# EAGLE schematic efi-shield-rev01 (EAGLE 7.3.0)

## Sheet 1 of 6: Connectors
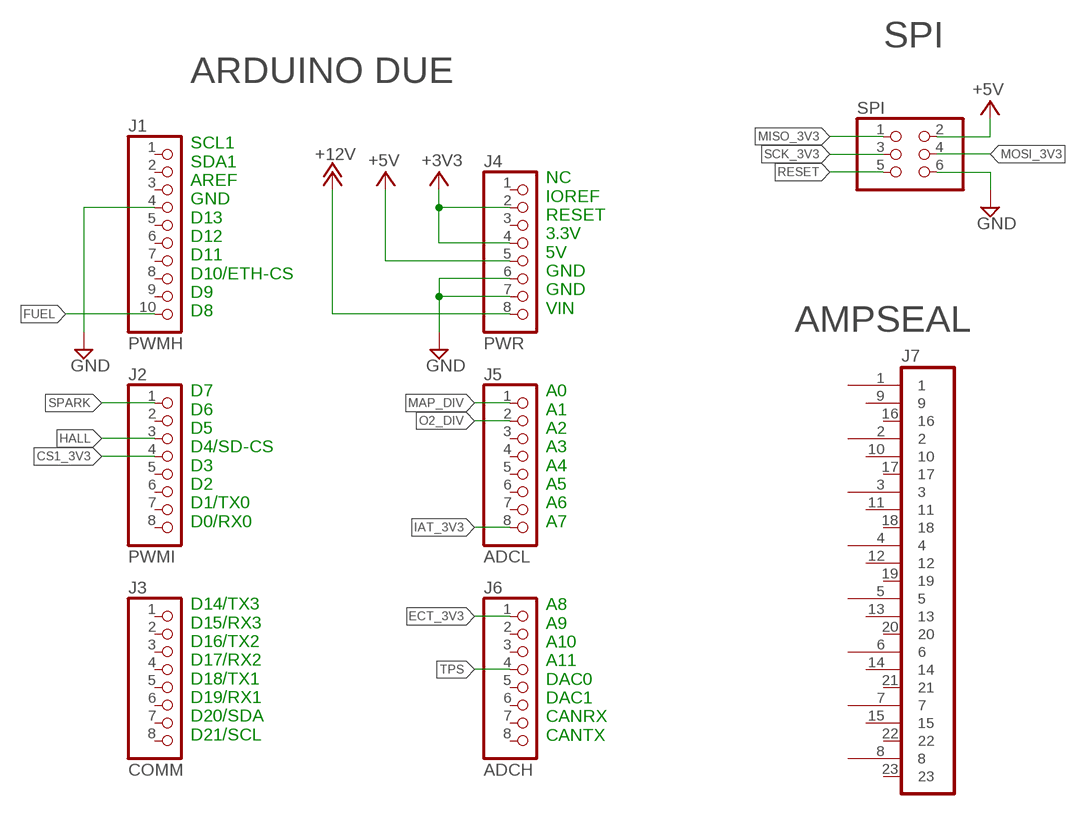
[diagram p0: schematic, sheet 1]

### Parts
J1  PWMH  PINHD-1X10  [1X10]
J2  PWMI  PINHD-1X8  [1X08]
J3  COMM  PINHD-1X8  [1X08]
J4  PWR  PINHD-1X8  [1X08]
J5  ADCL  PINHD-1X8  [1X08]
J6  ADCH  PINHD-1X8  [1X08]
J7  AMPSEAL-23POS-HEADER  [AMPSEAL-HEADER-23POS-RA]
SPI  PINHD-2X3  [2X03]

### Nets
+3V3: J4.2 J4.4
+5V: J4.5 SPI.2
+12V: J4.8
CS1_3V3: J2.4
ECT_3V3: J6.1
FUEL: J1.10
GND: J1.4 J4.6 J4.7 SPI.6
HALL: J2.3
IAT_3V3: J5.8
MAP_DIV: J5.1
MISO_3V3: SPI.1
MOSI_3V3: SPI.4
O2_DIV: J5.2
RESET: SPI.5
SCK_3V3: SPI.3
SPARK: J2.1
TPS: J6.4
Unconnected: J1.1 J1.2 J1.3 J1.5 J1.6 J1.7 J1.8 J1.9 J2.2 J2.5 J2.6 J2.7 J2.8 J3.1 J3.2 J3.3 J3.4 J3.5 J3.6 J3.7 J3.8 J4.1 J4.3 J5.3 J5.4 J5.5 J5.6 J5.7 J6.2 J6.3 J6.5 J6.6 J6.7 J6.8 J7.1 J7.2 J7.3 J7.4 J7.5 J7.6 J7.7 J7.8 J7.9 J7.10 J7.11 J7.12 J7.13 J7.14 J7.15 J7.16 J7.17 J7.18 J7.19 J7.20 J7.21 J7.22 J7.23

### Notes on the sheet
- SPI
- ARDUINO DUE
- SCL1
  SDA1
  AREF
  GND
  D13
  D12
  D11
  D10/ETH-CS
  D9
  D8
- NC
  IOREF
  RESET
  3.3V
  5V
  GND
  GND
  VIN
- AMPSEAL
- D7
  D6
  D5
  D4/SD-CS
  D3
  D2
  D1/TX0
  D0/RX0
- A0
  A1
  A2
  A3
  A4
  A5
  A6
  A7
- A8
  A9
  A10
  A11
  DAC0
  DAC1
  CANRX
  CANTX
- D14/TX3
  D15/RX3
  D16/TX2
  D17/RX2
  D18/TX1
  D19/RX1
  D20/SDA
  D21/SCL

## Sheet 2 of 6: ACTUATORS

## Sheet 3 of 6: FILTERS + ADC

## Sheet 4 of 6: TACH

## Sheet 5 of 6: CAN

## Sheet 6 of 6: LEDs

## Library data of the parts
J1 = cpsmv:PINHD-1X10: PIN HEADER; DATASHEET_LINK: http://www.joeknowselectronics.com/index.php/products/headers.html; MANUFACTURER: Joe Knows Electronics; MANUFACTURER_PN: n/a; PACKAGE: 1X10; SUPPLIER: Joe Knows Electronics; SUPPLIER_PN: n/a
J2-J6 = cpsmv:PINHD-1X8: PIN HEADER; DATASHEET_LINK: http://www.joeknowselectronics.com/index.php/products/headers.html; MANUFACTURER: Joe Knows Electronics; MANUFACTURER_PN: n/a; PACKAGE: 1X8; SUPPLIER: Joe Knows Electronics; SUPPLIER_PN: n/a
J7 = cpsmv:AMPSEAL-23POS-HEADER: 23 position male header, wire-to-board, sealing connector; DATASHEET_LINK: http://www.te.com/commerce/DocumentDelivery/DDEController?Action=srchrtrv&DocNm=776087&DocType=Customer+Drawing&DocLang=English; MANUFACTURER: TE Connectivity; MANUFACTURER_PN: 776087-1; PACKAGE: AMPSEAL-HEADER-23POS-RA; SUPPLIER: Digi-Key; SUPPLIER_PN: A107007-ND
SPI = pinhead:PINHD-2X3: PIN HEADER